# EAGLE design Bats-n-Gons (EAGLE 9.5.2)

## Sheet 1 of 2
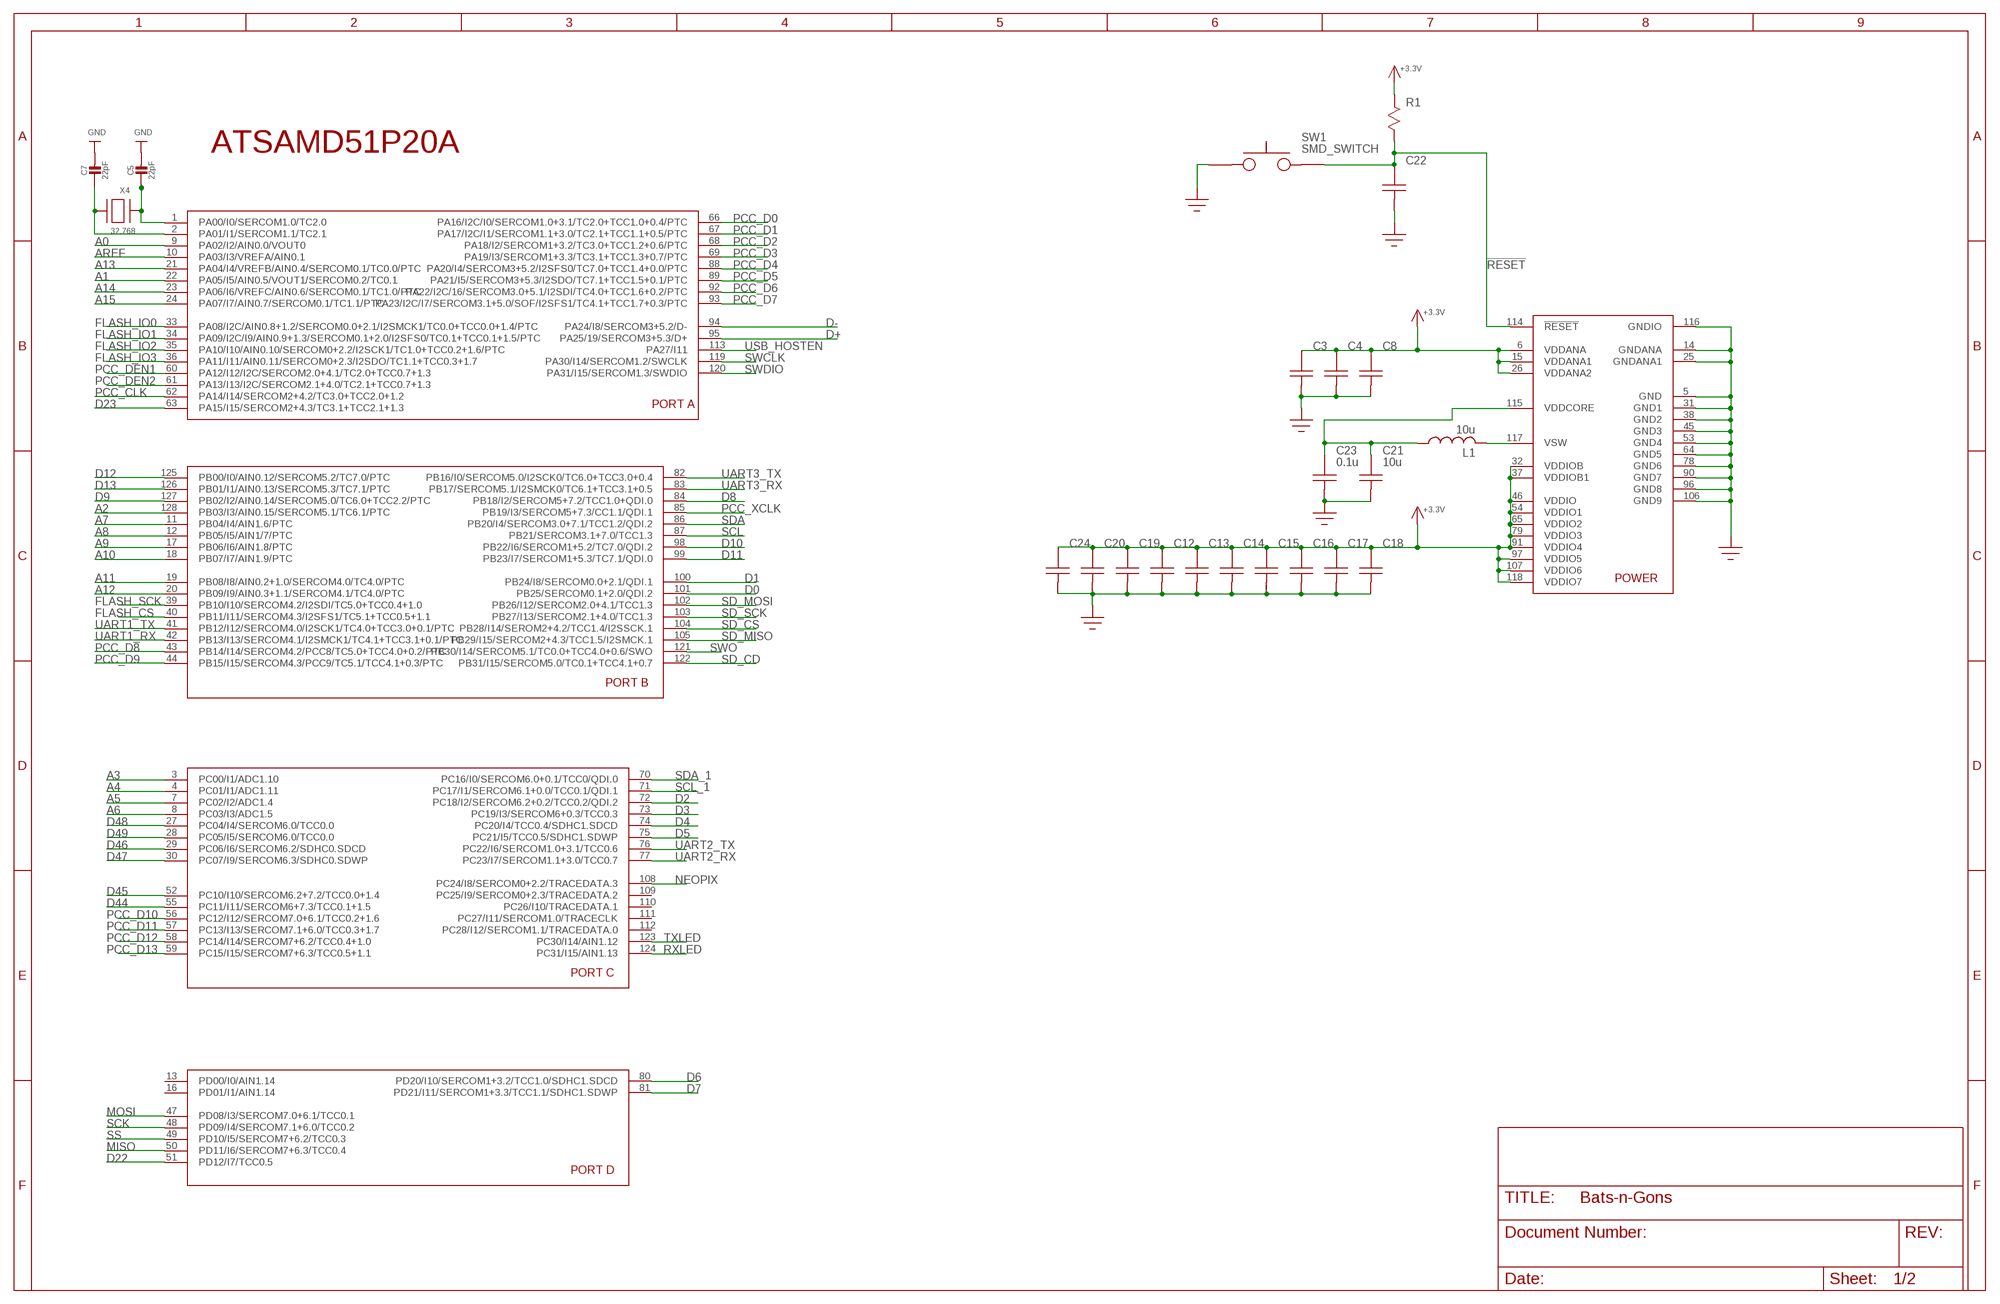
[diagram p0: schematic, sheet 1]

### Parts
C3  C0603  [C0603]
C4  C0603  [C0603]
C5  22pF  CAP_CERAMIC0603_NO  [0603-NO]
C7  22pF  CAP_CERAMIC0603_NO  [0603-NO]
C8  C0603  [C0603]
C12  C0603  [C0603]
C13  C0603  [C0603]
C14  C0603  [C0603]
C15  C0603  [C0603]
C16  C0603  [C0603]
C17  C0603  [C0603]
C18  C0603  [C0603]
C19  C0603  [C0603]
C20  C0603  [C0603]
C21  10u  C0603  [C0603]
C22  C0603  [C0603]
C23  0.1u  C0603  [C0603]
C24  C0603  [C0603]
L1  10u  INDUCTOR2424  [L24X24]
R1  R0603  [R0603]
SW1  SMD_SWITCH  [SMD_SWITCH]
U1  SAMD51PXXA  [SQFP-S-14X14-128]
X4  32.768  XTAL-3.2X1.5  [XTAL3215]

### Nets
!RESET!: C22.P$2 R1.P$2 SW1.P$3 SW1.P$4 U1.114(!RESET) ; also sheet 2
+3.3V: C3.P$2 C4.P$2 C8.P$2 C12.P$2 C13.P$2 C14.P$2 C15.P$2 C16.P$2 C17.P$2 C18.P$2 C19.P$2 C20.P$2 C24.P$2 R1.P$1 U1.6(VDDANA) U1.15(VDDANA1) U1.26(VDDANA2) U1.32(VDDIOB) U1.37(VDDIOB1) U1.46(VDDIO) U1.54(VDDIO1) U1.65(VDDIO2) U1.79(VDDIO3) U1.91(VDDIO4) U1.97(VDDIO5) U1.107(VDDIO6) U1.118(VDDIO7) ; also sheet 2
A0: U1.9(PA02/I2/AIN0.0/VOUT0) ; also sheet 2
A1: U1.22(PA05/I5/AIN0.5/VOUT1/SERCOM0.2/TC0.1) ; also sheet 2
A2: U1.128(PB03/I3/AIN0.15/SERCOM5.1/TC6.1/PTC) ; also sheet 2
A3: U1.3(PC00/I1/ADC1.10)
A4: U1.4(PC01/I1/ADC1.11)
A5: U1.7(PC02/I2/ADC1.4)
A6: U1.8(PC03/I3/ADC1.5)
A7: U1.11(PB04/I4/AIN1.6/PTC)
A8: U1.12(PB05/I5/AIN1/7/PTC)
A9: U1.17(PB06/I6/AIN1.8/PTC)
A10: U1.18(PB07/I7/AIN1.9/PTC)
A11: U1.19(PB08/I8/AIN0.2+1.0/SERCOM4.0/TC4.0/PTC)
A12: U1.20(PB09/I9/AIN0.3+1.1/SERCOM4.1/TC4.0/PTC)
A13: U1.21(PA04/I4/VREFB/AIN0.4/SERCOM0.1/TC0.0/PTC)
A14: U1.23(PA06/I6/VREFC/AIN0.6/SERCOM0.1/TC1.0/PTC)
A15: U1.24(PA07/I7/AIN0.7/SERCOM0.1/TC1.1/PTC)
AREF [aref]: U1.10(PA03/I3/VREFA/AIN0.1)
D0: U1.101(PB25/SERCOM0.1+2.0/QDI.2)
D1: U1.100(PB24/I8/SERCOM0.0+2.1/QDI.1)
D2: U1.72(PC18/I2/SERCOM6.2+0.2/TCC0.2/QDI.2)
D3: U1.73(PC19/I3/SERCOM6+0.3/TCC0.3)
D4: U1.74(PC20/I4/TCC0.4/SDHC1.SDCD)
D5: U1.75(PC21/I5/TCC0.5/SDHC1.SDWP)
D6: U1.80(PD20/I10/SERCOM1+3.2/TCC1.0/SDHC1.SDCD)
D7: U1.81(PD21/I11/SERCOM1+3.3/TCC1.1/SDHC1.SDWP)
D8: U1.84(PB18/I2/SERCOM5+7.2/TCC1.0+QDI.0)
D9: U1.127(PB02/I2/AIN0.14/SERCOM5.0/TC6.0+TCC2.2/PTC)
D10: U1.98(PB22/I6/SERCOM1+5.2/TC7.0/QDI.2)
D11: U1.99(PB23/I7/SERCOM1+5.3/TC7.1/QDI.0)
D12: U1.125(PB00/I0/AIN0.12/SERCOM5.2/TC7.0/PTC)
D13: U1.126(PB01/I1/AIN0.13/SERCOM5.3/TC7.1/PTC) ; also sheet 2
D22: U1.51(PD12/I7/TCC0.5)
D23: U1.63(PA15/I15/SERCOM2+4.3/TC3.1+TCC2.1+1.3)
D44: U1.55(PC11/I11/SERCOM6+7.3/TCC0.1+1.5)
D45: U1.52(PC10/I10/SERCOM6.2+7.2/TCC0.0+1.4)
D46: U1.29(PC06/I6/SERCOM6.2/SDHC0.SDCD) ; also sheet 2
D47: U1.30(PC07/I9/SERCOM6.3/SDHC0.SDWP)
D48: U1.27(PC04/I4/SERCOM6.0/TCC0.0)
D49: U1.28(PC05/I5/SERCOM6.0/TCC0.0)
D+: U1.95(PA25/19/SERCOM3+5.3/D+) ; also sheet 2
D-: U1.94(PA24/I8/SERCOM3+5.2/D-) ; also sheet 2
FLASH_CS: U1.40(PB11/I11/SERCOM4.3/I2SFS1/TC5.1+TCC0.5+1.1)
FLASH_IO0: U1.33(PA08/I2C/AIN0.8+1.2/SERCOM0.0+2.1/I2SMCK1/TC0.0+TCC0.0+1.4/PTC)
FLASH_IO1: U1.34(PA09/I2C/I9/AIN0.9+1.3/SERCOM0.1+2.0/I2SFS0/TC0.1+TCC0.1+1.5/PTC)
FLASH_IO2: U1.35(PA10/I10/AIN0.10/SERCOM0+2.2/I2SCK1/TC1.0+TCC0.2+1.6/PTC)
FLASH_IO3: U1.36(PA11/I11/AIN0.11/SERCOM0+2.3/I2SDO/TC1.1+TCC0.3+1.7)
FLASH_SCK: U1.39(PB10/I10/SERCOM4.2/I2SDI/TC5.0+TCC0.4+1.0)
GND [gnd]: C3.P$1 C4.P$1 C5.2 C7.2 C8.P$1 C12.P$1 C13.P$1 C14.P$1 C15.P$1 C16.P$1 C17.P$1 C18.P$1 C19.P$1 C20.P$1 C21.P$1 C22.P$1 C23.P$1 C24.P$1 SW1.P$1 SW1.P$2 U1.5(GND) U1.14(GNDANA) U1.25(GNDANA1) U1.31(GND1) U1.38(GND2) U1.45(GND3) U1.53(GND4) U1.64(GND5) U1.78(GND6) U1.90(GND7) U1.96(GND8) U1.106(GND9) U1.116(GNDIO) ; also sheet 2
MISO: U1.50(PD11/I6/SERCOM7+6.3/TCC0.4)
MOSI: U1.47(PD08/I3/SERCOM7.0+6.1/TCC0.1)
N$9: C5.1 U1.1(PA00/I0/SERCOM1.0/TC2.0) X4.P$1
N$12: C7.1 U1.2(PA01/I1/SERCOM1.1/TC2.1) X4.P$2
N$18: C21.P$2 C23.P$2 L1.1 U1.115(VDDCORE)
N$19: L1.2 U1.117(VSW)
NEOPIX: U1.108(PC24/I8/SERCOM0+2.2/TRACEDATA.3) ; also sheet 2
PCC_CLK: U1.62(PA14/I14/SERCOM2+4.2/TC3.0+TCC2.0+1.2)
PCC_D0: U1.66(PA16/I2C/I0/SERCOM1.0+3.1/TC2.0+TCC1.0+0.4/PTC)
PCC_D1: U1.67(PA17/I2C/I1/SERCOM1.1+3.0/TC2.1+TCC1.1+0.5/PTC)
PCC_D2: U1.68(PA18/I2/SERCOM1+3.2/TC3.0+TCC1.2+0.6/PTC)
PCC_D3: U1.69(PA19/I3/SERCOM1+3.3/TC3.1+TCC1.3+0.7/PTC)
PCC_D4: U1.88(PA20/I4/SERCOM3+5.2/I2SFS0/TC7.0+TCC1.4+0.0/PTC)
PCC_D5: U1.89(PA21/I5/SERCOM3+5.3/I2SDO/TC7.1+TCC1.5+0.1/PTC)
PCC_D6: U1.92(PA22/I2C/16/SERCOM3.0+5.1/I2SDI/TC4.0+TCC1.6+0.2/PTC)
PCC_D7: U1.93(PA23/I2C/I7/SERCOM3.1+5.0/SOF/I2SFS1/TC4.1+TCC1.7+0.3/PTC)
PCC_D8: U1.43(PB14/I14/SERCOM4.2/PCC8/TC5.0+TCC4.0+0.2/PTC)
PCC_D9: U1.44(PB15/I15/SERCOM4.3/PCC9/TC5.1/TCC4.1+0.3/PTC)
PCC_D10: U1.56(PC12/I12/SERCOM7.0+6.1/TCC0.2+1.6)
PCC_D11: U1.57(PC13/I13/SERCOM7.1+6.0/TCC0.3+1.7)
PCC_D12: U1.58(PC14/I14/SERCOM7+6.2/TCC0.4+1.0)
PCC_D13: U1.59(PC15/I15/SERCOM7+6.3/TCC0.5+1.1)
PCC_DEN1: U1.60(PA12/I12/I2C/SERCOM2.0+4.1/TC2.0+TCC0.7+1.3)
PCC_DEN2: U1.61(PA13/I13/I2C/SERCOM2.1+4.0/TC2.1+TCC0.7+1.3)
PCC_XCLK: U1.85(PB19/I3/SERCOM5+7.3/CC1.1/QDI.1)
RXLED: U1.124(PC31/I15/AIN1.13) ; also sheet 2
SCK: U1.48(PD09/I4/SERCOM7.1+6.0/TCC0.2)
SCL: U1.87(PB21/SERCOM3.1+7.0/TCC1.3)
SCL_1: U1.71(PC17/I1/SERCOM6.1+0.0/TCC0.1/QDI.1)
SD_CD: U1.122(PB31/I15/SERCOM5.0/TC0.1+TCC4.1+0.7)
SD_CS: U1.104(PB28/I14/SEROM2+4.2/TCC1.4/I2SSCK.1)
SD_MISO: U1.105(PB29/I15/SERCOM2+4.3/TCC1.5/I2SMCK.1)
SD_MOSI: U1.102(PB26/I12/SERCOM2.0+4.1/TCC1.3)
SD_SCK: U1.103(PB27/I13/SERCOM2.1+4.0/TCC1.3)
SDA: U1.86(PB20/I4/SERCOM3.0+7.1/TCC1.2/QDI.2)
SDA_1: U1.70(PC16/I0/SERCOM6.0+0.1/TCC0/QDI.0)
SS: U1.49(PD10/I5/SERCOM7+6.2/TCC0.3)
SWCLK: U1.119(PA30/I14/SERCOM1.2/SWCLK) ; also sheet 2
SWDIO: U1.120(PA31/I15/SERCOM1.3/SWDIO) ; also sheet 2
SWO: U1.121(PB30/I14/SERCOM5.1/TC0.0+TCC4.0+0.6/SWO)
TXLED: U1.123(PC30/I14/AIN1.12) ; also sheet 2
UART1_RX: U1.42(PB13/I13/SERCOM4.1/I2SMCK1/TC4.1+TCC3.1+0.1/PTC) ; also sheet 2
UART1_TX: U1.41(PB12/I12/SERCOM4.0/I2SCK1/TC4.0+TCC3.0+0.1/PTC) ; also sheet 2
UART2_RX: U1.77(PC23/I7/SERCOM1.1+3.0/TCC0.7)
UART2_TX: U1.76(PC22/I6/SERCOM1.0+3.1/TCC0.6)
UART3_RX: U1.83(PB17/SERCOM5.1/I2SMCK0/TC6.1+TCC3.1+0.5)
UART3_TX: U1.82(PB16/I0/SERCOM5.0/I2SCK0/TC6.0+TCC3.0+0.4)
USB_HOSTEN: U1.113(PA27/I11)
Unconnected: U1.13(PD00/I0/AIN1.14) U1.16(PD01/I1/AIN1.14) U1.109(PC25/I9/SERCOM0+2.3/TRACEDATA.2) U1.110(PC26/I10/TRACEDATA.1) U1.111(PC27/I11/SERCOM1.0/TRACECLK) U1.112(PC28/I12/SERCOM1.1/TRACEDATA.0)

### Notes on the sheet
- ATSAMD51P20A

## Sheet 2 of 2
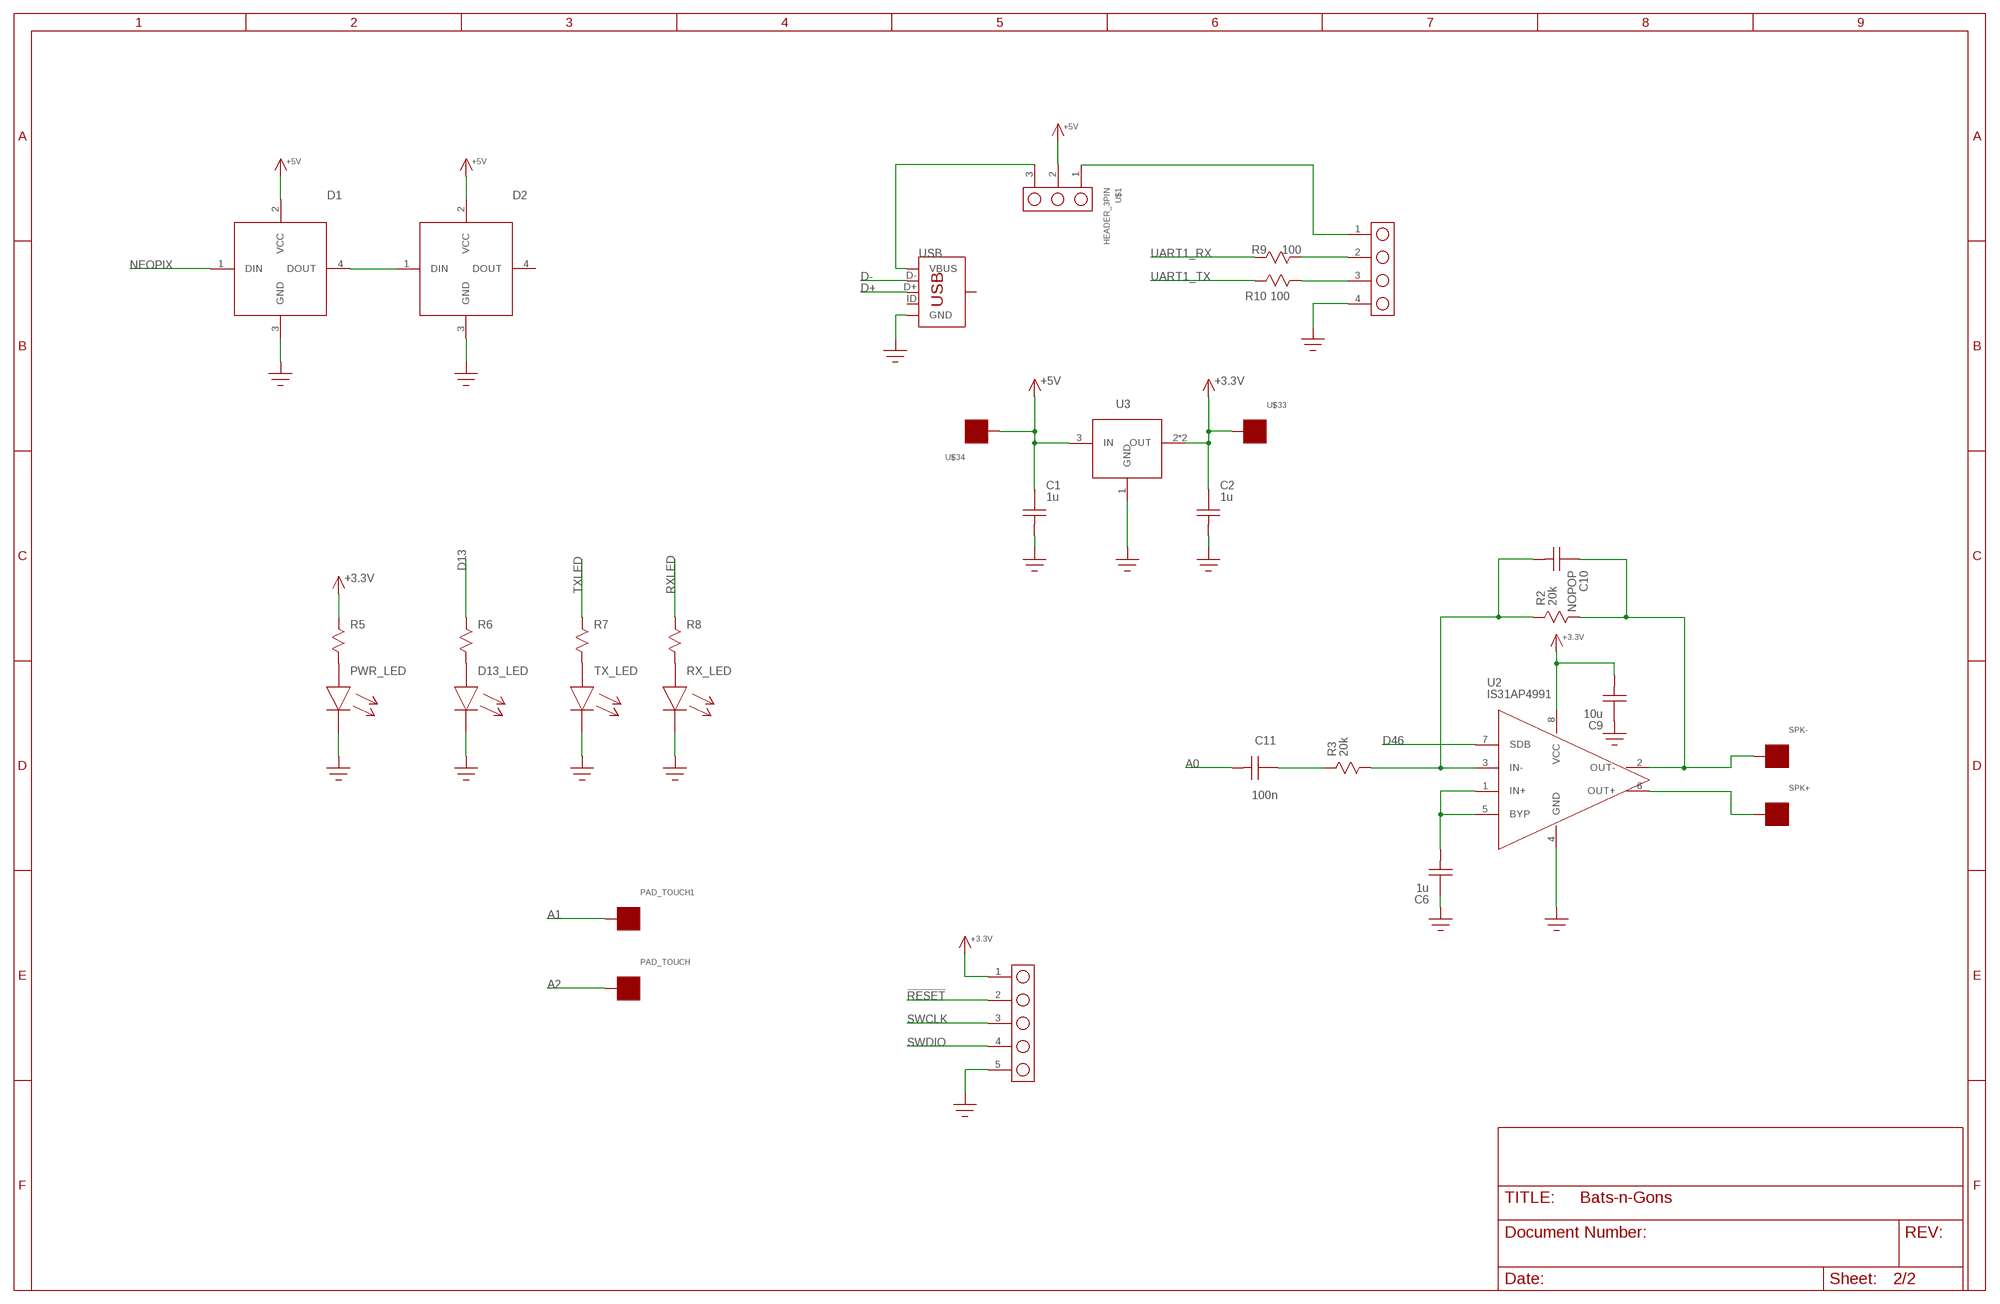
[diagram p1: schematic, sheet 2]

### Parts
C1  1u  C0603  [C0603]
C2  1u  C0603  [C0603]
C6  1u  C0603  [C0603]
C9  10u  C1206  [1206]
C10  NOPOP  C0603  [C0603]
C11  100n  C0603  [C0603]
D1  NEOPIXEL  [LED-RGB-THRU]
D2  NEOPIXEL  [LED-RGB-THRU]
D13_LED  LED_0603  [LED_0603]
J1  HEADER_4PIN  [HEADER_4PIN]
J2  HEADER_5PIN  [HEADER_5PIN]
PAD_TOUCH  PAD  [PAD-ROUND-100MIL-MASK]
PAD_TOUCH1  PAD  [PAD-ROUND-100MIL-MASK]
PWR_LED  LED_0603  [LED_0603]
R2  20k  R0603  [R0603]
R3  20k  R0603  [R0603]
R5  R0603  [R0603]
R6  R0603  [R0603]
R7  R0603  [R0603]
R8  R0603  [R0603]
R9  100  R0603  [R0603]
R10  100  R0603  [R0603]
RX_LED  LED_0603  [LED_0603]
SPK+  PAD100MIL  [PAD_100MIL]
SPK-  PAD100MIL  [PAD_100MIL]
TX_LED  LED_0603  [LED_0603]
U2  IS31AP4991  IS31AP4991SOIC  [SOIC8]
U3  AZ1117E  [SOT-223]
U$1  HEADER_3PIN  [HEADER_3PIN]
U$33  PADROUND-50MIL  [PAD-ROUND-50MIL]
U$34  PADROUND-50MIL  [PAD-ROUND-50MIL]
USB  USB_MICRO_LEGS  [USB_MICRO_LEGS_2]

### Nets
!RESET!: J2.2 ; also sheet 1
+3.3V: C2.P$2 C9.P$1 J2.1 R5.P$1 U2.8(VCC) U3.2(OUT) U3.4(OUT) U$33.P$1 ; also sheet 1
+5V: C1.P$2 D1.2(VCC) D2.2(VCC) U3.3(IN) U$1.2 U$34.P$1
A0: C11.P$1 ; also sheet 1
A1: PAD_TOUCH1.P$1 ; also sheet 1
A2: PAD_TOUCH.P$1 ; also sheet 1
D13: R6.P$1 ; also sheet 1
D46: U2.7(SDB) ; also sheet 1
D+: USB.D+ ; also sheet 1
D-: USB.D- ; also sheet 1
GND [gnd]: C1.P$1 C2.P$1 C6.P$2 C9.P$2 D1.3(GND) D2.3(GND) D13_LED.C J1.4 J2.5 PWR_LED.C RX_LED.C TX_LED.C U2.4(GND) U3.1(GND) USB.GND ; also sheet 1
N$1: C6.P$1 U2.1(IN+) U2.5(BYP)
N$2: C10.P$2 R2.P$2 SPK-.P$1 U2.2(OUT-)
N$3: C10.P$1 R2.P$1 R3.P$2 U2.3(IN-)
N$4: C11.P$2 R3.P$1
N$5: SPK+.P$1 U2.6(OUT+)
N$7: J1.3 R10.P$2
N$8: PWR_LED.A R5.P$2
N$10: D13_LED.A R6.P$2
N$11: R7.P$2 TX_LED.A
N$13: R8.P$2 RX_LED.A
N$14: J1.2 R9.P$2
N$15: U$1.3 USB.VBUS
N$16: J1.1 U$1.1
N$17: D1.4(DOUT) D2.1(DIN)
NEOPIX: D1.1(DIN) ; also sheet 1
RXLED: R8.P$1 ; also sheet 1
SWCLK: J2.3 ; also sheet 1
SWDIO: J2.4 ; also sheet 1
TXLED: R7.P$1 ; also sheet 1
UART1_RX: R9.P$1 ; also sheet 1
UART1_TX: R10.P$1 ; also sheet 1
Unconnected: D2.4(DOUT) USB.ID USB.P$4(SHIELD)

## Library data of the parts
C1 C2 = yapo:C
C3 C4 C6 C8-C24 = bats-n-gons:C
C5 C7 = microbuilder:CAP_CERAMIC: Ceramic Capacitors For new designs, use the packages preceded by an '_' character since they are more reliable: The following footprints should be used on most boards: _0402 - Standard footprint for regular board layouts _0603 - Standard footprint for regular board layouts _0805 - Standard footprint for regular board layouts _1206 - Standard footprint for regular board layouts For extremely tight-pitch boards where space is at a premium, the following 'micro-pitch' footprints can be used (smaller pads, no silkscreen outline, etc.): _0402MP - Micro-pitch footprint for very dense/compact boards _0603MP - Micro-pitch footprint for very dense/compact boards _0805MP - Micro-pitch footprint for very dense/compact boards _1206MP - Micro-pitch footprint for very dense/compact boards
D1 D2 = bats-n-gons:NEOPIXEL
D13_LED PWR_LED RX_LED TX_LED = bats-n-gons:LED_0603
J1 = yapo:HEADER_4PIN
J2 = bats-n-gons:HEADER_5PIN
L1 = bats-n-gons:INDUCTOR
PAD_TOUCH PAD_TOUCH1 SPK+ SPK- U$33 U$34 = bats-n-gons:PAD
R1-R3 R5-R10 = bats-n-gons:R
SW1 = bats-n-gons:SMD_SWITCH
U1 = microbuilder:SAMD51PXXA: SAMD51 P variant
U2 = bats-n-gons:IS31AP4991
U3 = yapo:AZ1117E
U$1 = bats-n-gons:HEADER_3PIN
USB = SophiEaglev9:USB_MICRO_LEGS
X4 = adafruit2:XTAL: Low cost SMT crystals, no capacitors included http://www.ladyada.net/library/eagle

## Board
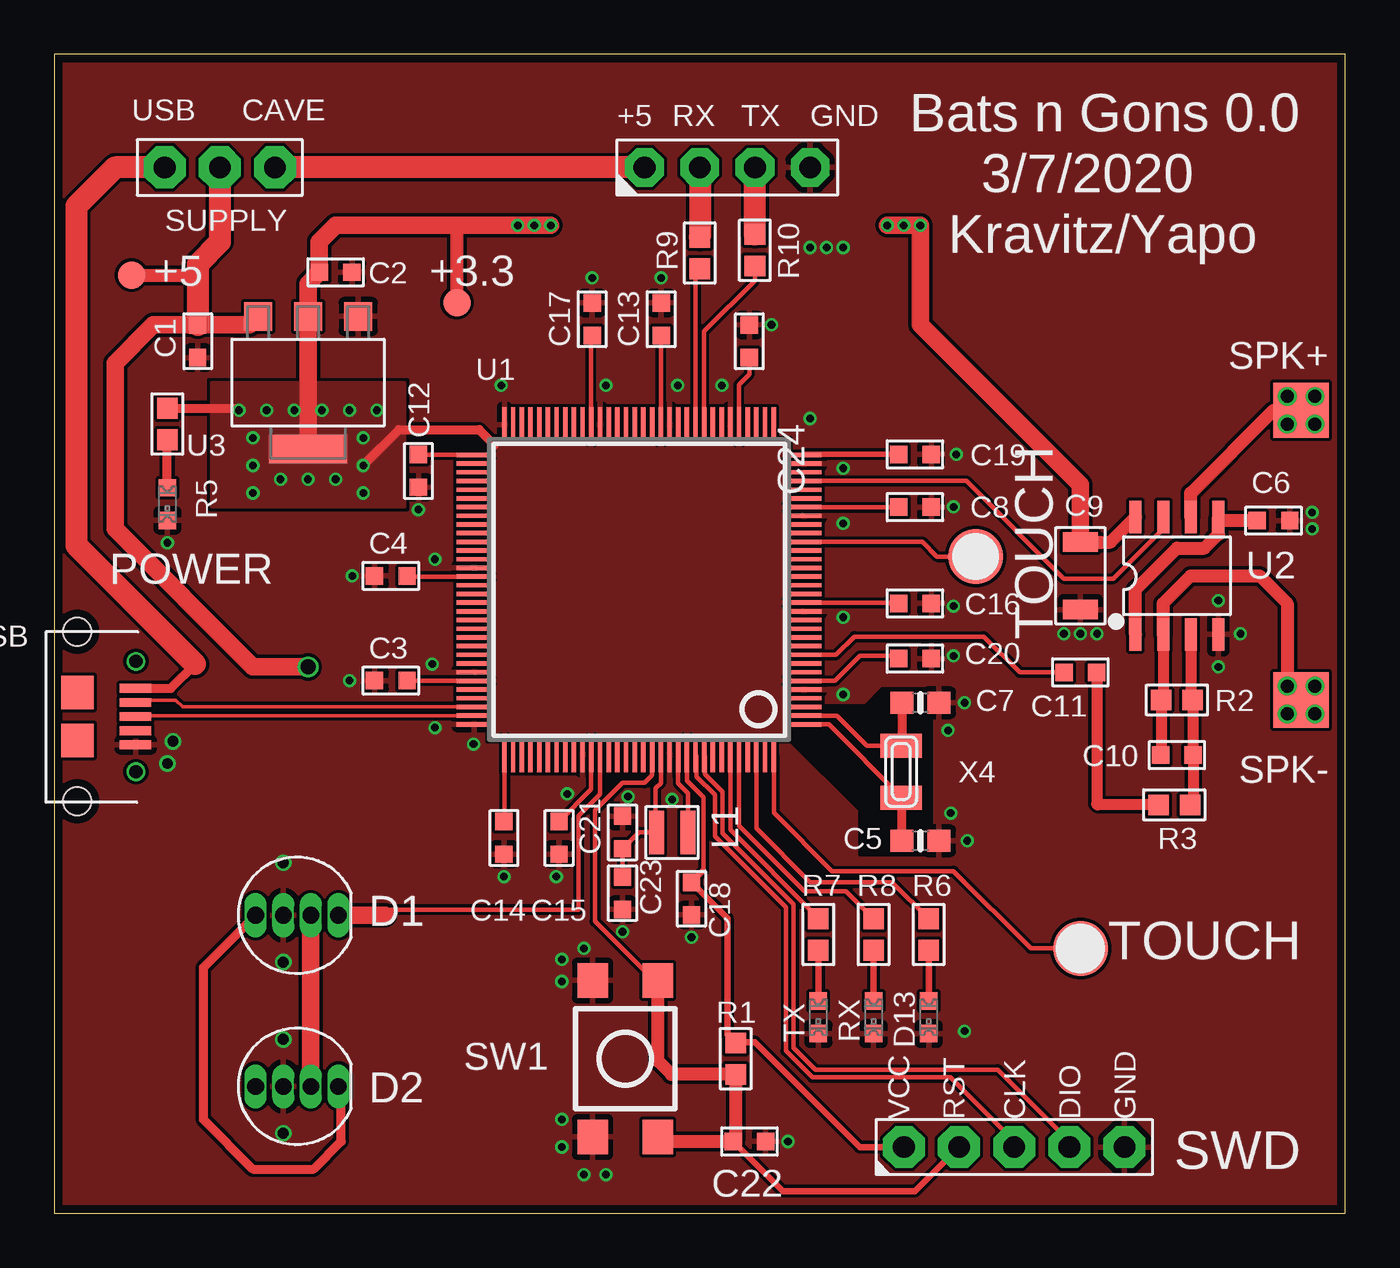
[diagram p2: board, top side]
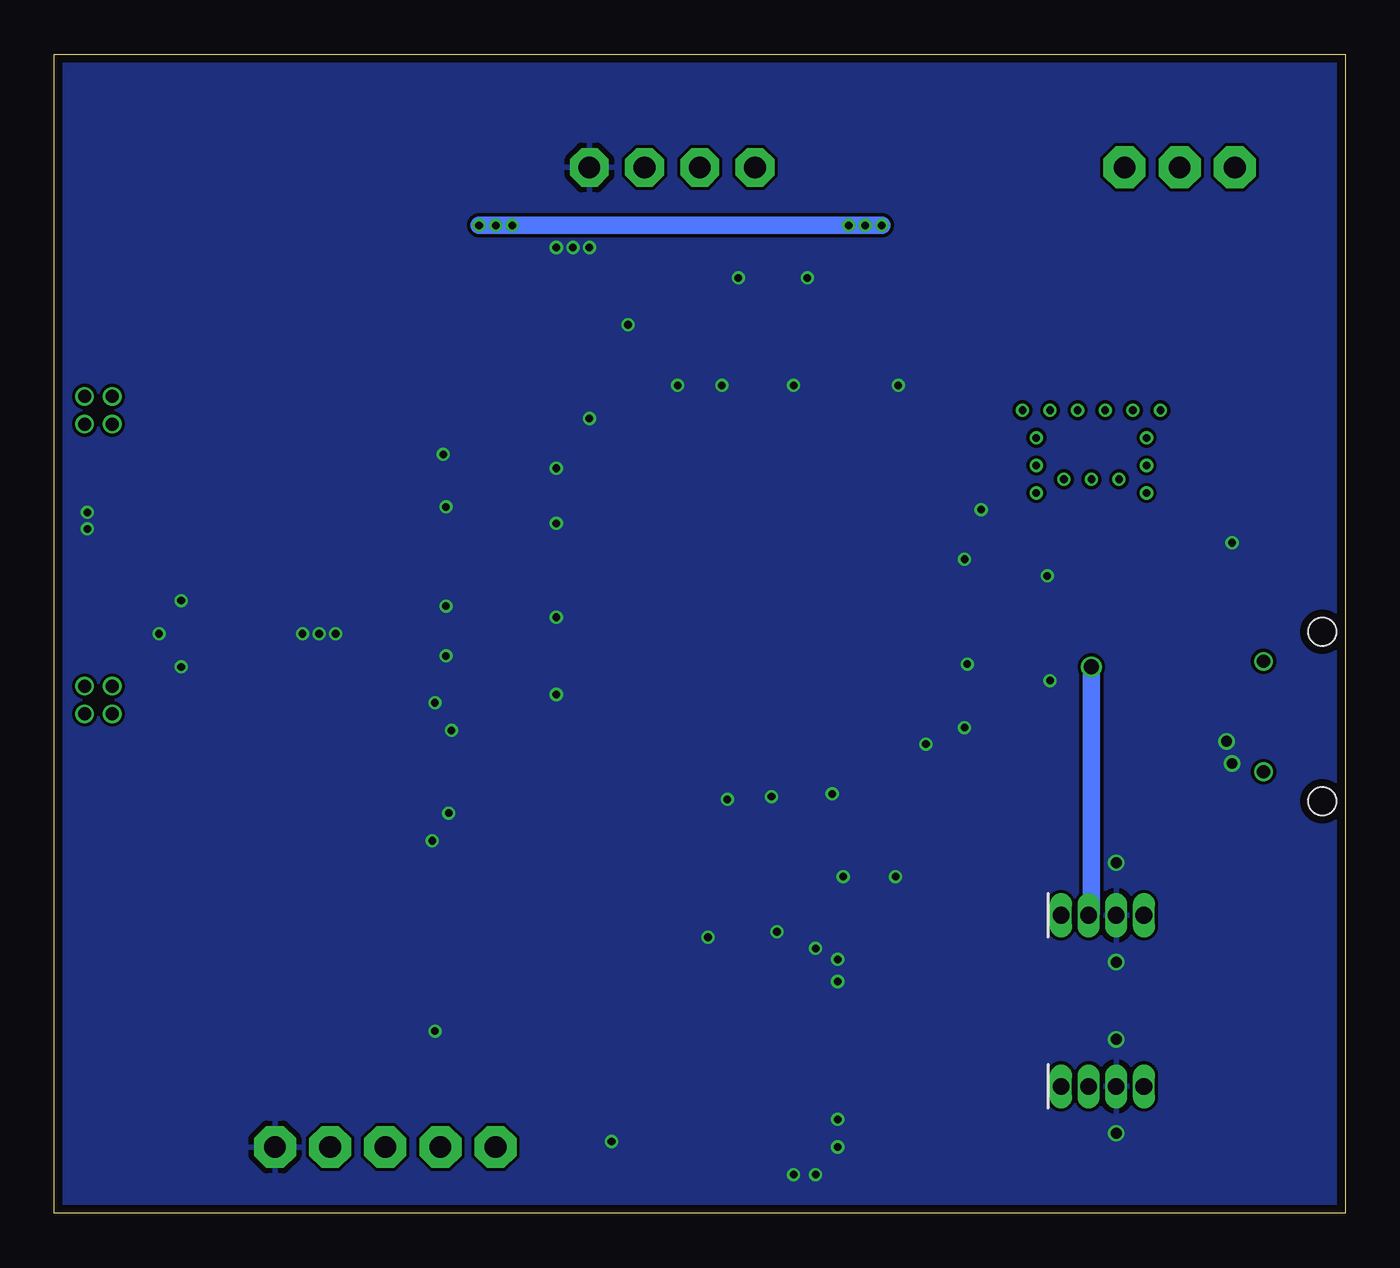
[diagram p3: board, bottom side, seen from below]

Size 59.44 x 53.34 mm. Coordinates in mm from the lower left corner, seen from the top.
Outline: 0,0 59.44,0 59.44,53.34 0,53.34 0,0
Copper layers (1*16): Top 0.035559375mm / dielectric 1.6mm / Bottom 0.035559375mm
Design rules "oshpark-2layer *": minimum track width 6mil, minimum drill 10mil, track to track 6mil, track to pad 6mil, pad to pad 6mil, via to via 6mil, smd to smd 6mil, copper to edge 15mil, drill to drill 6mil, minimum pad ring 5mil, minimum via ring 5mil, stop-mask expansion 2.5mil, vias tented up to drill 20mil, thermal gap 10mil
tRestrict: area 33.8,16.5 to 40.4,24.1

### Footprints (pad centres in the part's own frame; a part is rotated, then mirrored left to right if it is on the bottom)
C0603 = smd 0.8 x 0.8: P$1 -0.75,0; P$2 0.75,0
0603-NO = smd 1.075 x 1: 1 -0.85,0; 2 0.85,0
1206 = smd 0.9 x 1.6: P$1 -1.55,0; P$2 1.55,0
LED-RGB-THRU = drill 0.762 pad 0.889 long: 1 1.905,0; 2 0.635,0; 3 -0.635,0; 4 -1.905,0
LED_0603 = smd 0.8 x 0.8: A -0.75,0; C 0.75,0
HEADER_4PIN = drill 1 pad 1.778 octagon: 1 -3.81,0; 2 -1.27,0; 3 1.27,0; 4 3.81,0
HEADER_5PIN = drill 1 pad 1.93 octagon: 1 -5.08,0; 2 -2.54,0; 3 0,0; 4 2.54,0; 5 5.08,0
L24X24 = smd 0.7 x 2: 1 -0.725,0; 2 0.725,0
PAD-ROUND-100MIL-MASK = smd 2.54 x 2.54: P$1 0,0
R0603 = smd 0.95 x 0.95: P$1 -0.725,0; P$2 0.725,0
PAD_100MIL = smd 2.54 x 2.54: P$1 0,0
SMD_SWITCH = smd 1.6 x 1.4: P$1 -3.6,1.5; P$2 3.6,1.5; P$3 3.6,-1.5; P$4 -3.6,-1.5
SQFP-S-14X14-128 = smd 0.2 x 1.6: 1 -6.2,-7.6; 2 -5.8,-7.6; 3 -5.4,-7.6; 4 -5,-7.6; 5 -4.6,-7.6; 6 -4.2,-7.6; 7 -3.8,-7.6; 8 -3.4,-7.6; 9 -3,-7.6; 10 -2.6,-7.6; 11 -2.2,-7.6; 12 -1.8,-7.6; 13 -1.4,-7.6; 14 -1,-7.6; 15 -0.6,-7.6; 16 -0.2,-7.6; 17 0.2,-7.6; 18 0.6,-7.6; 19 1,-7.6; 20 1.4,-7.6; 21 1.8,-7.6; 22 2.2,-7.6; 23 2.6,-7.6; 24 3,-7.6; 25 3.4,-7.6; 26 3.8,-7.6; 27 4.2,-7.6; 28 4.6,-7.6; 29 5,-7.6; 30 5.4,-7.6; 31 5.8,-7.6; 32 6.2,-7.6; 65 6.2,7.6; 66 5.8,7.6; 67 5.4,7.6; 68 5,7.6; 69 4.6,7.6; 70 4.2,7.6; 71 3.8,7.6; 72 3.4,7.6; 73 3,7.6; 74 2.6,7.6; 75 2.2,7.6; 76 1.8,7.6; 77 1.4,7.6; 78 1,7.6; 79 0.6,7.6; 80 0.2,7.6; 81 -0.2,7.6; 82 -0.6,7.6; 83 -1,7.6; 84 -1.4,7.6; 85 -1.8,7.6; 86 -2.2,7.6; 87 -2.6,7.6; 88 -3,7.6; 89 -3.4,7.6; 90 -3.8,7.6; 91 -4.2,7.6; 92 -4.6,7.6; 93 -5,7.6; 94 -5.4,7.6; 95 -5.8,7.6; 96 -6.2,7.6 | smd 1.6 x 0.2: 33 7.6,-6.2; 34 7.6,-5.8; 35 7.6,-5.4; 36 7.6,-5; 37 7.6,-4.6; 38 7.6,-4.2; 39 7.6,-3.8; 40 7.6,-3.4; 41 7.6,-3; 42 7.6,-2.6; 43 7.6,-2.2; 44 7.6,-1.8; 45 7.6,-1.4; 46 7.6,-1; 47 7.6,-0.6; 48 7.6,-0.2; 49 7.6,0.2; 50 7.6,0.6; 51 7.6,1; 52 7.6,1.4; 53 7.6,1.8; 54 7.6,2.2; 55 7.6,2.6; 56 7.6,3; 57 7.6,3.4; 58 7.6,3.8; 59 7.6,4.2; 60 7.6,4.6; 61 7.6,5; 62 7.6,5.4; 63 7.6,5.8; 64 7.6,6.2; 97 -7.6,6.2; 98 -7.6,5.8; 99 -7.6,5.4; 100 -7.6,5; 101 -7.6,4.6; 102 -7.6,4.2; 103 -7.6,3.8; 104 -7.6,3.4; 105 -7.6,3; 106 -7.6,2.6; 107 -7.6,2.2; 108 -7.6,1.8; 109 -7.6,1.4; 110 -7.6,1; 111 -7.6,0.6; 112 -7.6,0.2; 113 -7.6,-0.2; 114 -7.6,-0.6; 115 -7.6,-1; 116 -7.6,-1.4; 117 -7.6,-1.8; 118 -7.6,-2.2; 119 -7.6,-2.6; 120 -7.6,-3; 121 -7.6,-3.4; 122 -7.6,-3.8; 123 -7.6,-4.2; 124 -7.6,-4.6; 125 -7.6,-5; 126 -7.6,-5.4; 127 -7.6,-5.8; 128 -7.6,-6.2
SOIC8 = smd 0.55 x 1.5: 1 -1.905,-2.7; 2 -0.635,-2.7; 3 0.635,-2.7; 4 1.905,-2.7; 5 1.905,2.7; 6 0.635,2.7; 7 -0.635,2.7; 8 -1.905,2.7
SOT-223 = smd 1.3 x 1.3: 1 -2.3,-3.05; 2 0,-3.05; 3 2.3,-3.05 | smd 3.6 x 1.3: 4 0,3.05
HEADER_3PIN = drill 1 pad 1.93 octagon: 1 -2.54,0; 2 0,0; 3 2.54,0
PAD-ROUND-50MIL = smd 1.27 x 1.27: P$1 0,0
USB_MICRO_LEGS_2 = smd 0.4 x 1.45: D+ 5.08,3.745; D- 4.43,3.745; GND 6.38,3.745; ID 5.73,3.745; VBUS 3.78,3.745 | drill 0.6: P$1 2.54,3.76; P$2 7.62,3.76 | smd 1.55 x 1.5: P$3 3.98,1.06; P$4 6.18,1.06 | hole 1.27: 8.98,1.06; 1.18,1.06
XTAL3215 = smd 1.1 x 1.9: P$1 1.2,0; P$2 -1.2,0

### Placement (x,y rotation side)
C1  6.6,40.13 90 top
C2  12.95,43.31 180 top
C3  15.49,24.51 0 top
C4  15.49,29.34 0 top
C5  39.88,17.14 0 top
C6  56.13,31.88 0 top
C7  39.88,23.5 0 top
C8  39.62,32.5 180 top
C9  47.24,29.34 270 top
C10  51.69,21.08 180 top
C11  47.24,24.89 0 top
C12  16.76,34.16 90 top
C13  27.94,41.15 270 top
C14  20.7,17.27 90 top
C15  23.24,17.27 90 top
C16  39.62,28.07 180 top
C17  24.77,41.15 270 top
C18  29.34,14.48 90 top
C19  39.62,34.92 180 top
C20  39.62,25.53 180 top
C21  26.16,17.53 270 top
C22  32,3.3 180 top
C23  26.16,14.73 90 top
C24  32,40.13 270 top
D1  11.18,13.72 0 top
D2  11.18,5.84 0 top
D13_LED  40.26,9.02 270 top
J1  30.99,48.13 0 top
J2  44.2,3.05 0 top
L1  28.45,17.53 0 top
PAD_TOUCH  47.24,12.19 0 top
PAD_TOUCH1  42.42,30.23 0 top
PWR_LED  5.21,32.64 270 top
R1  31.37,7.11 270 top
R2  51.69,23.62 180 top
R3  51.56,18.8 0 top
R5  5.21,36.32 270 top
R6  40.26,12.83 270 top
R7  35.18,12.83 270 top
R8  37.72,12.83 270 top
R9  29.72,44.2 90 top
R10  32.26,44.32 90 top
RX_LED  37.72,9.02 270 top
SPK+  57.4,36.96 180 top
SPK-  57.4,23.62 180 top
SW1  26.29,7.11 90 top
TX_LED  35.18,9.02 270 top
U1  26.92,28.7 90 top
U2  51.69,29.34 0 top
U3  11.68,38.23 180 top
U$1  7.62,48.13 180 top
U$33  18.54,41.91 0 top
U$34  3.56,43.18 0 top
USB  0,27.94 270 top
X4  38.99,20.32 270 top

### Tracks (layer width: path | path; a pad name or v marks a point on that pad's centre or on a via)
!RESET!
  Top 0.152: 27.52,10.98 SW1.P$3
  Top 0.203: U1.114 27.52,20.16 27.18,19.81 26.16,19.81 24.89,18.54 24.89,13.44 27.35,10.98 27.52,10.98
  Top 0.305: J2.2 39.62,1.02 33.54,1.02 C22.P$2
  Top 0.61: SW1.P$4 28,3.3 C22.P$2 31.37,3.42 R1.P$2 28.41,6.39 27.79,7.01 SW1.P$3
+3.3V  (via drill 0.35)
  Top 0.203: U1.26 C8.P$2 38.99,32.38 38.99,32.39 C8.P$2 | U1.15 38.33,28.1 | U1.107 24.72,19.5 C15.P$2 | U1.97 20.72,18.05 C14.P$2 | U1.91 16.25,24.5 C3.P$2 | U1.79 16.28,29.3 C4.P$2 | U1.65 16.8,34.9 C12.P$2 | U1.6 35.93,24.5 37.08,25.65 38.75,25.65 C20.P$2 | U1.54 24.72,40.36 C17.P$2 | U1.46 27.92,40.38 C13.P$2 | U1.118 29.12,19.9 29.89,19.14 29.89,15.78 | U1.37 31.52,38.13 32,38.61 C24.P$2
  Top 0.254: 38.33,28.1 C16.P$2 | 29.89,15.78 C18.P$2 | U1.32 34.55,34.92 C19.P$2
  Top 0.305: C18.P$2 30.99,13.58 30.99,8.22 R1.P$1 31.41,7.87 32.26,7.87 37.08,3.05 J2.1
  Top 0.406: v14.22,34.42 15.88,36.07 19.56,36.07 20.27,35.36 20.27,35.35 | R5.P$1 8.42,37.05 v8.51,36.96
  Top 0.61: C9.P$1 48.63,30.89 U2.8 | U$33.P$1 18.54,45.21 18.29,45.47
  Top 0.813: U3.4 U3.2 11.68,42.79 C2.P$2 12.2,44.72 12.95,45.47 18.29,45.47 v21.34,45.47 v22.1,45.47 v22.86,45.47 | C9.P$1 47.24,33.53 39.88,40.89 v39.88,45.47 v39.12,45.47 v38.35,45.47
  Bottom 0.813: v39.88,45.47 v21.34,45.47
  other vias: 9.14,35.69 9.14,34.42 10.41,33.78 11.68,33.78 12.95,33.78 14.22,35.69 13.59,36.96 12.32,36.96 11.05,36.96 9.78,36.96 14.86,36.96 14.22,33.15 9.14,33.15
  pour Top (no thermals): 7.24,38.23 7.24,32.51 16.13,32.51 16.13,38.23
  pour Top: 20.07,35.56 33.78,35.56 33.78,21.84 20.07,21.84
+5V  (via drill 0.7)
  Top 0.61: U$34.P$1 6.35,43.18 6.6,42.93
  Top 0.813: U3.3 8.99,40.88 C1.P$2 4.56,40.88 2.79,39.12 2.79,31.5 9.14,25.15 v11.68,25.15 | D2.2 D1.2
  Top 1.016: U$1.2 7.62,44.7 6.6,43.69 6.6,42.93 C1.P$2
  Bottom 0.813: v11.68,25.15 11.68,13.84 D1.2
A0
  Top 0.203: U1.9 35.99,25.7 36.83,26.54 42.8,26.54 44.45,24.89 C11.P$1
A1
  Top 0.203: U1.22 39.96,30.9 40.64,30.23 PAD_TOUCH1.P$1
A2
  Top 0.203: U1.128 33.12,18.44 35.81,15.75 41.4,15.75 44.96,12.19 PAD_TOUCH.P$1
D13
  Top 0.203: U1.126 32.32,17.71 34.8,15.24 38.57,15.24 R6.P$1
D46
  Top 0.203: U1.29 41.99,33.7 46.48,29.21 48.77,29.21 51.05,31.5 U2.7
D+
  Top 0.152: U1.95 3.75,22.9 USB.D+
D-
  Top 0.152: U1.94 5.91,23.3 5.59,23.62 3.86,23.62 USB.D-
GND  (via drill 0.35, 0.5)
  Top 0.152: SW1.P$2 24.75,10.67 | C14.P$1 20.83,16.39 | 23.37,16.39 C15.P$1 23.23,16.51 | C18.P$1 29.46,13.6
  Top 0.203: D13_LED.C 40.37,8.38 | SW1.P$1 24.89,3.41
  Bottom 0.254: J1.4 35.31,48.13
  other vias: 5.46,21.72 5.21,20.7 54.61,26.67 57.91,32.26 41.4,32.51 36.32,34.29 41.53,34.92 47.24,26.67 42.04,17.14 41.91,23.5 36.32,23.88 41.91,8.38 33.78,3.3 23.37,10.67 20.7,15.49 23.11,15.49 26.16,12.95 17.53,22.35 13.59,24.51 24.77,43.05 57.91,31.5 53.59,28.19 53.59,25.15 27.94,43.05 30.73,38.1 25.4,38.1 20.57,38.1 13.72,29.34 17.53,30.1 17.4,25.27 23.62,19.3 28.45,19.05 36.32,27.43 16.76,32.38 34.8,36.58 19.3,21.59 41.4,27.94 41.4,25.65 34.8,44.45 35.56,44.45 36.32,44.45 5.21,30.86 10.54,11.56 10.54,8 10.54,16.13 10.54,3.68 23.37,11.68 23.37,4.32 23.37,3.05 24.38,1.78 25.4,1.78 24.38,12.19 41.15,22.23 41.27,18.41 29.34,12.7 26.42,19.18 36.32,31.75 33.02,40.89 28.7,38.1 46.48,26.67 48.01,26.67
  pour Top (rank 2): -5.59,-3.94 -5.59,57.78 67.06,57.78 67.06,-3.94
  pour Bottom: -10.92,-8 72.01,-8 72.01,61.85 -10.92,61.85
N$1
  Top 0.61: C6.P$1 53.75,31.88 U2.5 53.59,31.24 52.96,30.61 51.69,30.61 49.78,28.7 U2.1
N$2  (via drill 0.6)
  Top 0.508: U2.2 51.05,23.71 R2.P$2 50.96,21.11 C10.P$2
  Top 0.61: SPK-.P$1 v58.04,24.26 | SPK-.P$1 v58.04,22.99 | SPK-.P$1 v56.77,22.99 | SPK-.P$1 v56.77,24.26 56.77,28.07 55.5,29.34 52.32,29.34 51.05,28.07 U2.2
N$3
  Top 0.508: U2.3 52.32,23.71 R2.P$1 52.41,21.11 C10.P$1 52.44,18.95 R3.P$2
N$4
  Top 0.508: R3.P$1 48.04,18.8 47.99,18.84 C11.P$2
N$5  (via drill 0.6)
  Top 0.61: U2.6 52.32,33.15 56.13,36.96 58.04,36.96 57.4,37.59 v56.77,37.59 SPK+.P$1 | SPK+.P$1 v56.77,36.32 | SPK+.P$1 v58.04,37.59 | SPK+.P$1 v58.04,36.32
N$7
  Top 1.016: R10.P$2 J1.3
N$8
  Top 0.406: PWR_LED.A R5.P$2
N$9
  Top 0.203: U1.1 35.66,22.5 38.99,19.18 X4.P$1
  Top 0.406: C5.1 39.03,19.08 X4.P$1
N$10
  Top 0.305: R6.P$2 D13_LED.A
N$11
  Top 0.305: R7.P$2 TX_LED.A
N$12
  Top 0.203: U1.2 36.03,22.9 37.41,21.52 X4.P$2
  Top 0.406: C7.1 39.03,21.56 X4.P$2
N$13
  Top 0.305: R8.P$2 RX_LED.A
N$14
  Top 1.016: J1.2 R9.P$2
N$15
  Top 0.406: USB.VBUS 5.36,24.16 6.48,25.27
  Top 1.016: U$1.3 2.79,48.13 1.02,46.35 1.02,30.73 6.48,25.27
N$16
  Top 1.016: J1.1 U$1.1
N$17
  Top 0.406: D1.4 6.86,11.3 6.86,4.32 9.14,2.03 11.94,2.03 13.21,3.3 13.21,5.71 D2.1
N$18
  Top 0.203: U1.115 27.92,19.8 27.69,19.56 27.69,17.56 L1.1 26.91,17.53 C21.P$2 C23.P$2
N$19
  Top 0.203: U1.117 28.72,19.79 29.17,19.34 L1.2
NEOPIX
  Top 0.203: U1.108 25.12,19.28 24.13,18.29 24.13,13.97 15.49,13.97 15.24,13.72
  Top 0.813: D1.1 15.24,13.72
RXLED
  Top 0.203: U1.124 31.52,17.84 34.54,14.82 36.45,14.82 R8.P$1
SWCLK
  Top 0.203: U1.119 29.57,21.06 29.57,20.09 30.41,19.25 30.41,17.35 33.68,14.08 33.68,7.47 34.91,6.25 41.25,6.25 44.2,3.3 J2.3
SWDIO
  Top 0.203: U1.120 29.97,21.06 29.97,20.2 30.77,19.4 30.77,17.5 34.04,14.23 34.04,7.62 35.05,6.6 43.43,6.6 46.74,3.3 J2.4
TXLED
  Top 0.203: R7.P$1 35.18,13.72 35.05,13.72 31.12,17.64 U1.123
UART1_RX
  Top 0.203: R9.P$1 29.52,43.28 U1.42
UART1_TX
  Top 0.203: U1.41 29.92,40.59 32.26,42.93 R10.P$1

### Text on the board
tPlace: USB | CAVE | +5 | RX | TX | GND | Bats n Gons 0.0 | 3/7/2020 | SUPPLY | Kravitz/Yapo | +5 | +3.3 | POWER | TOUCH | D1 | TOUCH | D2 | VCC | RST | CLK | DIO | GND | SWD
tNames: TX | RX | D13